# EAGLE schematic Main_DMB-4773 (EAGLE 6.5.0)

## Sheet 1 of 2
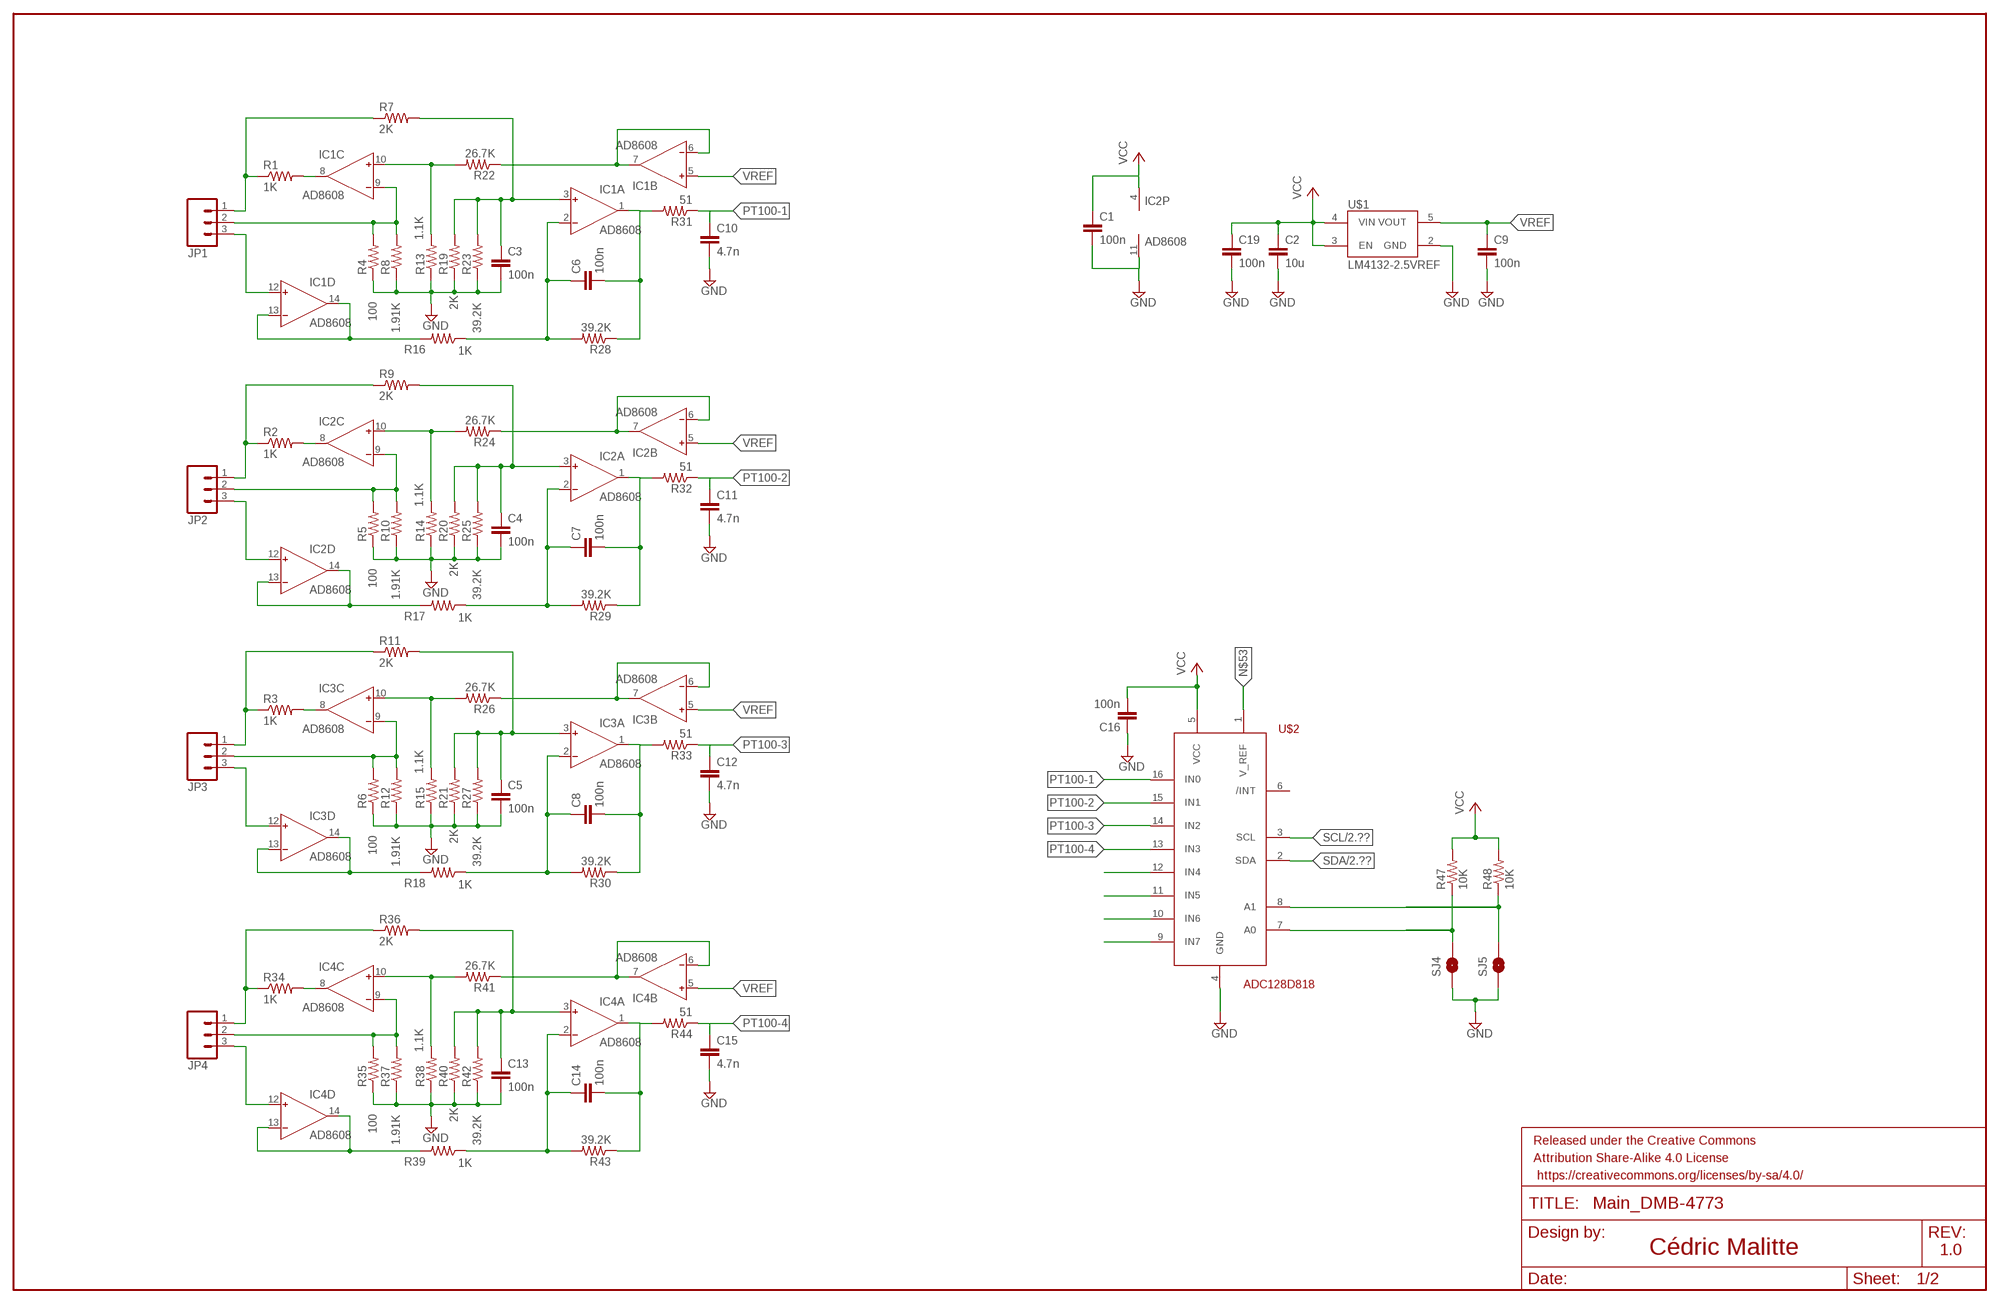
[diagram p0: schematic, sheet 1]

### Parts
C1  100n  CAP0805  [0805]
C2  10u  CAP0805  [0805]
C3  100n  CAP0805  [0805]
C4  100n  CAP0805  [0805]
C5  100n  CAP0805  [0805]
C6  100n  CAP0805  [0805]
C7  100n  CAP0805  [0805]
C8  100n  CAP0805  [0805]
C9  100n  CAP0805  [0805]
C10  4.7n  CAP0805  [0805]
C11  4.7n  CAP0805  [0805]
C12  4.7n  CAP0805  [0805]
C13  100n  CAP0805  [0805]
C14  100n  CAP0805  [0805]
C15  4.7n  CAP0805  [0805]
C16  100n  CAP0805  [0805]
C19  100n  CAP0805  [0805]
FRAME1  FRAME-LEDGER  [CREATIVE_COMMONS]
IC1  AD8608  AD8609R  [SO14]
IC2  AD8608  AD8609R  [SO14]
IC3  AD8608  AD8609R  [SO14]
IC4  AD8608  AD8609R  [SO14]
JP1  M03SCREW  [SCREWTERMINAL-3.5MM-3]
JP2  M03SCREW  [SCREWTERMINAL-3.5MM-3]
JP3  M03SCREW  [SCREWTERMINAL-3.5MM-3]
JP4  M03SCREW  [SCREWTERMINAL-3.5MM-3]
R1  1K  RESISTOR0805-RES  [0805]
R2  1K  RESISTOR0805-RES  [0805]
R3  1K  RESISTOR0805-RES  [0805]
R4  100  RESISTOR0805-RES  [0805]
R5  100  RESISTOR0805-RES  [0805]
R6  100  RESISTOR0805-RES  [0805]
R7  2K  RESISTOR0805-RES  [0805]
R8  1.91K  RESISTOR0805-RES  [0805]
R9  2K  RESISTOR0805-RES  [0805]
R10  1.91K  RESISTOR0805-RES  [0805]
R11  2K  RESISTOR0805-RES  [0805]
R12  1.91K  RESISTOR0805-RES  [0805]
R13  1.1K  RESISTOR0805-RES  [0805]
R14  1.1K  RESISTOR0805-RES  [0805]
R15  1.1K  RESISTOR0805-RES  [0805]
R16  1K  RESISTOR0805-RES  [0805]
R17  1K  RESISTOR0805-RES  [0805]
R18  1K  RESISTOR0805-RES  [0805]
R19  2K  RESISTOR0805-RES  [0805]
R20  2K  RESISTOR0805-RES  [0805]
R21  2K  RESISTOR0805-RES  [0805]
R22  26.7K  RESISTOR0805-RES  [0805]
R23  39.2K  RESISTOR0805-RES  [0805]
R24  26.7K  RESISTOR0805-RES  [0805]
R25  39.2K  RESISTOR0805-RES  [0805]
R26  26.7K  RESISTOR0805-RES  [0805]
R27  39.2K  RESISTOR0805-RES  [0805]
R28  39.2K  RESISTOR0805-RES  [0805]
R29  39.2K  RESISTOR0805-RES  [0805]
R30  39.2K  RESISTOR0805-RES  [0805]
R31  51  RESISTOR0805-RES  [0805]
R32  51  RESISTOR0805-RES  [0805]
R33  51  RESISTOR0805-RES  [0805]
R34  1K  RESISTOR0805-RES  [0805]
R35  100  RESISTOR0805-RES  [0805]
R36  2K  RESISTOR0805-RES  [0805]
R37  1.91K  RESISTOR0805-RES  [0805]
R38  1.1K  RESISTOR0805-RES  [0805]
R39  1K  RESISTOR0805-RES  [0805]
R40  2K  RESISTOR0805-RES  [0805]
R41  26.7K  RESISTOR0805-RES  [0805]
R42  39.2K  RESISTOR0805-RES  [0805]
R43  39.2K  RESISTOR0805-RES  [0805]
R44  51  RESISTOR0805-RES  [0805]
R47  10K  RESISTOR0805-RES  [0805]
R48  10K  RESISTOR0805-RES  [0805]
SJ4  SOLDERJUMPERNC  [SJ_2S]
SJ5  SOLDERJUMPERNC  [SJ_2S]
U$1  LM4132-2.5VREF  LM4128-2.5VREF  [SOT23-5]
U$2  ADC128D818  [SSOP16]

### Nets
GND: C1.2 C2.2 C3.2 C4.2 C5.2 C9.2 C10.2 C11.2 C12.2 C13.2 C15.2 C16.1 C19.2 IC2.11(P:V-) R4.1 R5.1 R6.1 R8.1 R10.1 R12.1 R13.1 R14.1 R15.1 R19.1 R20.1 R21.1 R23.1 R25.1 R27.1 R35.1 R37.1 R38.1 R40.1 R42.1 SJ4.1 SJ5.1 U$1.2(GND) U$2.4(GND) ; also sheet 2
N$1: IC2.12(D:IN+) JP2.3
N$2: IC2.13(D:IN-) IC2.14(D:OUT) R17.2
N$3: IC2.9(C:IN-) JP2.2 R5.2 R10.2
N$4: JP2.1 R2.1 R9.1
N$5: IC2.8(C:OUT) R2.2
N$6: IC3.12(D:IN+) JP3.3
N$7: IC3.13(D:IN-) IC3.14(D:OUT) R18.2
N$8: IC2.10(C:IN+) R14.2 R24.2
N$9: C4.1 IC2.3(A:IN+) R9.2 R20.2 R25.2
N$10: IC2.6(B:IN-) IC2.7(B:OUT) R24.1
N$11: IC3.9(C:IN-) JP3.2 R6.2 R12.2
N$12: JP3.1 R3.1 R11.1
N$13: C7.1 IC2.2(A:IN-) R17.1 R29.2
N$14: C7.2 IC2.1(A:OUT) R29.1 R32.2
N$15: IC3.8(C:OUT) R3.2
N$16: IC3.10(C:IN+) R15.2 R26.2
N$17: C5.1 IC3.3(A:IN+) R11.2 R21.2 R27.2
N$18: IC3.6(B:IN-) IC3.7(B:OUT) R26.1
N$19: C8.1 IC3.2(A:IN-) R18.1 R30.2
N$20: C8.2 IC3.1(A:OUT) R30.1 R33.2
N$21: IC4.12(D:IN+) JP4.3
N$22: IC4.13(D:IN-) IC4.14(D:OUT) R39.2
N$23: IC4.9(C:IN-) JP4.2 R35.2 R37.2
N$24: JP4.1 R34.1 R36.1
N$25: IC4.8(C:OUT) R34.2
N$26: IC4.10(C:IN+) R38.2 R41.2
N$27: C13.1 IC4.3(A:IN+) R36.2 R40.2 R42.2
N$28: IC4.6(B:IN-) IC4.7(B:OUT) R41.1
N$29: C14.1 IC4.2(A:IN-) R39.1 R43.2
N$30: C14.2 IC4.1(A:OUT) R43.1 R44.2
N$31: IC1.12(D:IN+) JP1.3
N$32: IC1.13(D:IN-) IC1.14(D:OUT) R16.2
N$33: IC1.9(C:IN-) JP1.2 R4.2 R8.2
N$34: JP1.1 R1.1 R7.1
N$35: IC1.8(C:OUT) R1.2
N$36: IC1.10(C:IN+) R13.2 R22.2
N$37: C3.1 IC1.3(A:IN+) R7.2 R19.2 R23.2
N$38: IC1.6(B:IN-) IC1.7(B:OUT) R22.1
N$39: C6.1 IC1.2(A:IN-) R16.1 R28.2
N$40: C6.2 IC1.1(A:OUT) R28.1 R31.2
N$45: U$2.12(IN4)
N$46: U$2.11(IN5)
N$47: U$2.10(IN6)
N$48: U$2.9(IN7)
N$51: R48.1 SJ5.2 U$2.8(A1)
N$52: R47.1 SJ4.2 U$2.7(A0)
N$53: U$2.1(V_REF)
PT100-1: C10.1 R31.1 U$2.16(IN0)
PT100-2: C11.1 R32.1 U$2.15(IN1)
PT100-3: C12.1 R33.1 U$2.14(IN2)
PT100-4: C15.1 R44.1 U$2.13(IN3)
SCL: U$2.3(SCL) ; also sheet 2
SDA: U$2.2(SDA) ; also sheet 2
VCC: C1.1 C2.1 C16.2 C19.1 IC2.4(P:V+) R47.2 R48.2 U$1.3(EN) U$1.4(VIN) U$2.5(VCC) ; also sheet 2
VREF: C9.1 IC1.5(B:IN+) IC2.5(B:IN+) IC3.5(B:IN+) IC4.5(B:IN+) U$1.5(VOUT)
Unconnected: U$2.6(/INT)

### Notes on the sheet
- Cédric Malitte | 1.0

## Sheet 2 of 2
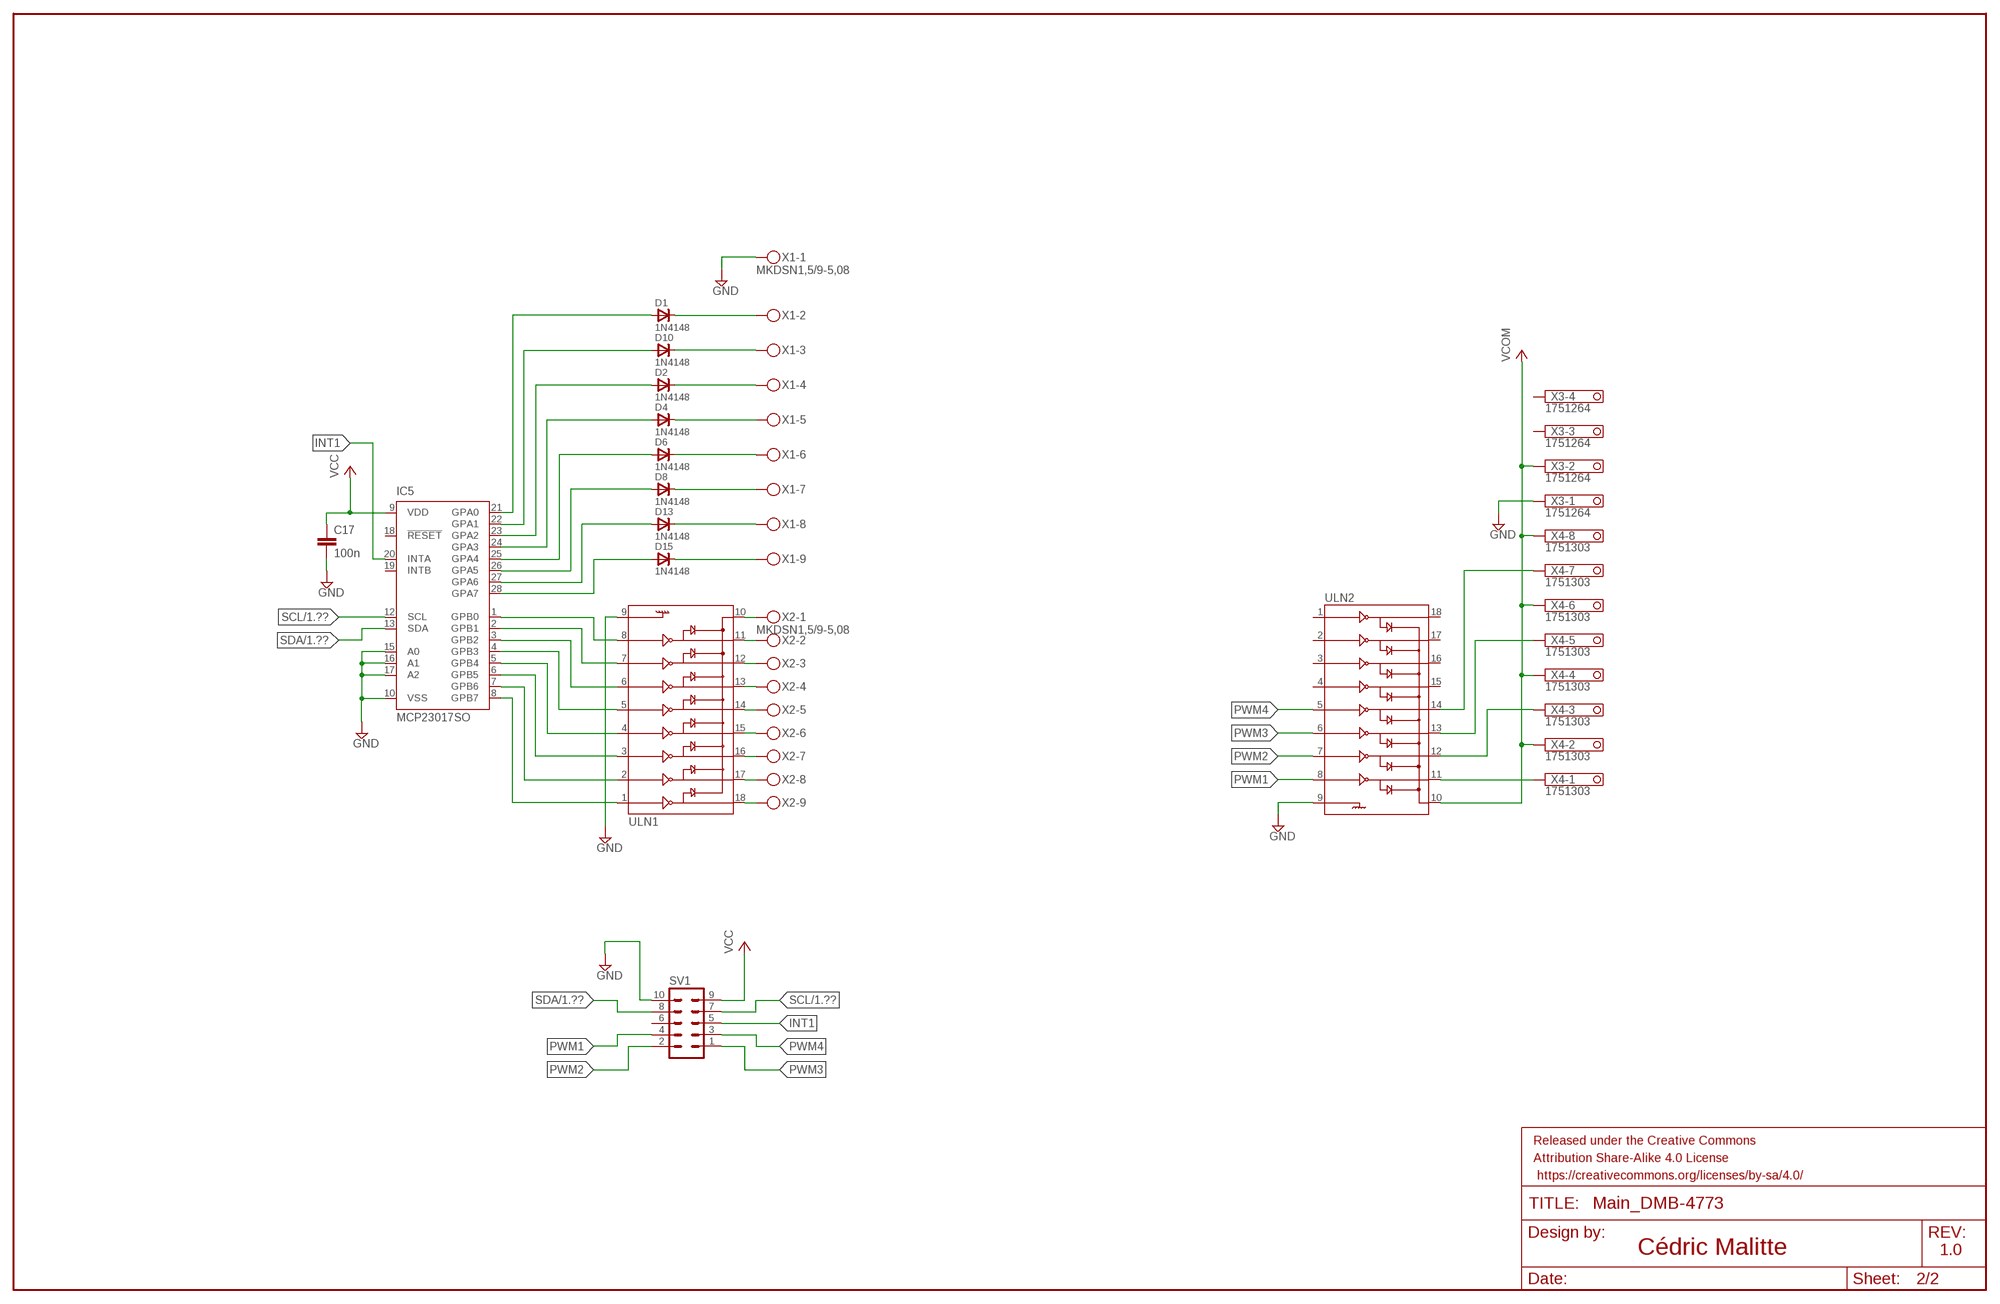
[diagram p1: schematic, sheet 2]

### Parts
C17  100n  CAP0805  [0805]
D1  1N4148  1N4148-MINIMELF  [DMINIMELF]
D2  1N4148  1N4148-MINIMELF  [DMINIMELF]
D4  1N4148  1N4148-MINIMELF  [DMINIMELF]
D6  1N4148  1N4148-MINIMELF  [DMINIMELF]
D8  1N4148  1N4148-MINIMELF  [DMINIMELF]
D10  1N4148  1N4148-MINIMELF  [DMINIMELF]
D13  1N4148  1N4148-MINIMELF  [DMINIMELF]
D15  1N4148  1N4148-MINIMELF  [DMINIMELF]
FRAME2  FRAME-LEDGER  [CREATIVE_COMMONS]
IC5  MCP23017SO  [SO28W]
SV1  ML10  [ML10]
ULN1  ULN2803SOIC  [SO018]
ULN2  ULN2803SOIC  [SO018]
X1  MKDSN1,5/9-5,08  [MKDSN1,5/9-5,08]
X2  MKDSN1,5/9-5,08  [MKDSN1,5/9-5,08]
X3  1751264  [1751264]
X4  1751303  [1751303]

### Nets
GND: C17.2 IC5.10(VSS) IC5.15(A0) IC5.16(A1) IC5.17(A2) SV1.10 ULN1.9 ULN2.9 X1.1 X3.1 ; also sheet 1
INT1: IC5.20(INTA) SV1.5
N$41: D1.C X1.2
N$42: D10.C X1.3
N$43: D2.C X1.4
N$44: D4.C X1.5
N$49: D4.A IC5.24(GPA3)
N$50: D6.C X1.6
N$54: D8.C X1.7
N$55: D10.A IC5.22(GPA1)
N$56: D13.C X1.8
N$57: ULN1.10 X2.1
N$58: ULN1.11 X2.2
N$59: ULN1.12 X2.3
N$60: ULN1.13 X2.4
N$61: ULN1.14 X2.5
N$62: ULN1.15 X2.6
N$63: ULN1.16 X2.7
N$64: ULN1.17 X2.8
N$65: ULN1.18 X2.9
N$66: IC5.1(GPB0) ULN1.8
N$67: IC5.2(GPB1) ULN1.7
N$68: IC5.3(GPB2) ULN1.6
N$69: IC5.4(GPB3) ULN1.5
N$70: IC5.5(GPB4) ULN1.4
N$71: IC5.6(GPB5) ULN1.3
N$72: IC5.7(GPB6) ULN1.2
N$73: IC5.8(GPB7) ULN1.1
N$74: ULN2.11 X4.1
N$75: ULN2.12 X4.3
N$76: ULN2.13 X4.5
N$77: ULN2.14 X4.7
N$79: D15.C X1.9
N$119: D1.A IC5.21(GPA0)
N$120: D2.A IC5.23(GPA2)
N$126: D6.A IC5.25(GPA4)
N$128: D8.A IC5.26(GPA5)
N$130: D13.A IC5.27(GPA6)
N$135: D15.A IC5.28(GPA7)
PWM1: SV1.4 ULN2.8
PWM2: SV1.2 ULN2.7
PWM3: SV1.1 ULN2.6
PWM4: SV1.3 ULN2.5
SCL: IC5.12(SCL) SV1.7 ; also sheet 1
SDA: IC5.13(SDA) SV1.8 ; also sheet 1
VCC: C17.1 IC5.9(VDD) SV1.9 ULN2.10 X3.2 X4.2 X4.4 X4.6 X4.8 ; supply symbol labelled VCOM ; also sheet 1
Unconnected: IC5.18(!RESET) IC5.19(INTB) SV1.6 ULN2.1 ULN2.2 ULN2.3 ULN2.4 ULN2.15 ULN2.16 ULN2.17 ULN2.18 X3.3 X3.4

### Notes on the sheet
- Cédric Malitte | 1.0

## Power pins joined to a net without a drawn wire
V+: IC1.4(P:V+) IC3.4(P:V+) IC4.4(P:V+)
V-: IC1.11(P:V-) IC3.11(P:V-) IC4.11(P:V-)

## Library data of the parts
C1-C17 C19 = SparkFun-Capacitors:CAP: Capacitor Standard 0603 ceramic capacitor, and 0.1" leaded capacitor.
D1 D2 D4 D6 D8 D10 D13 D15 = diodes:1N4148: 1N4148/LL4148/1N4448/LL4448: General purpose silicon diode 100V, 200mA, 500mW, 1V @ 10mA Wired packages: 1N4148/1N4448, MiniMELF package: LL4148/LL4448
FRAME1 FRAME2 = SparkFun-Aesthetics:FRAME-LEDGER: Schematic Frame Standard 11x14 US Ledger frame
IC1-IC4 = analog-devices:AD8609: Precision Micropower, Low Noise CMOS, Rail-to-Rail Input/Output Operational Amplifiers Source: http://www.analog.com/static/imported-files/data_sheets/AD8603_8607_8609.pdf; MPN: AD8609ARZ; OC_FARNELL: 1581951; OC_NEWARK: 19M0976
IC5 = microchip:MCP23017: http://ww1.microchip.com/downloads/en/DeviceDoc/21952a.pdf Source: http://ww1.microchip.com/downloads/en/DeviceDoc/21952a.pdf; MF: MICROCHIP; MPN: MCP23017-E/SO; OC_FARNELL: 1332087; OC_NEWARK: 31K2958
JP1-JP4 = SparkFun-Connectors:M03: Header 3 Standard 3-pin 0.1" header. Use with straight break away headers (SKU : PRT-00116), right angle break away headers (PRT-00553), swiss pins (PRT-00743), machine pins (PRT-00117), and female headers (PRT-00115). Molex polarized connector foot print use with SKU : PRT-08232 with associated crimp pins and housings.
R1-R44 R47 R48 = SparkFun-Passives:RESISTOR: Resistor Basic schematic elements and footprints for 0603, 1206, and PTH resistors.
SJ4 SJ5 = SparkFun-Retired:SOLDERJUMPER: Solder Jumper Standard SMD solder jumper. Used to automate production. Two varients : Normally Open and Normally Closed are the same, but have different paste layers. NC will have a large amount of paste and should jumper during reflow.
SV1 = con-harting-ml:ML10: HARTING; OC_FARNELL: unknown; OC_NEWARK: unknown
U$1 = SparkFun-PowerIC:LM4128-2.5VREF: .1% accurate low-current voltage reference
U$2 = linear:ADC128D818
ULN1 ULN2 = SparkFun-PowerIC:ULN2803: Darlington Driver ULN2803 Darlington array. 500mA max per channel, 8-channel package. Spark Fun Electronics SKU : COM-00312
X1 X2 = con-phoenix-508:MKDSN1,5/9-5,08: MKDSN 1,5/ 9-5,08 Printklemme Nennstrom: 13,5 A Nennspannung: 250 V Rastermaß: 5,08 mm Polzahl: 9 Anschlussart: Schraubanschluss Montage: Löten Anschlussrichtung Leiter/Platine: 0 ° Artikelnummer: 1729199 Source: http://eshop.phoenixcontact.com .. 1729199.pdf; MPN: SMKDSN1,5/9-5,08; OC_FARNELL: 1792912; OC_NEWARK: 70R0305
X3 = con-phoenix-350:1751264: MKDS 1/ 4-3,5 Printklemme Nennstrom: 10 A Bemessungsspannung: 160 V Raster: 3,5 mm Polzahl: 4 Montageart: Löten Anschlussart: Schraubanschluss Anschlussrichtung vom Leiter zur Platine: 0° Source: http://eshop.phoenixcontact.com .. 1751264.pdf; MPN: 1751264; OC_FARNELL: unknown; OC_NEWARK: 10R0934
X4 = con-phoenix-350:1751303: MKDS 1/ 8-3,5 Printklemme Nennstrom: 10 A Bemessungsspannung: 160 V Raster: 3,5 mm Polzahl: 8 Montageart: Löten Anschlussart: Schraubanschluss Anschlussrichtung vom Leiter zur Platine: 0° Source: http://eshop.phoenixcontact.com .. .pdf; OC_FARNELL: unknown; OC_NEWARK: unknown